# EAGLE schematic lm317_voltage_regulator (EAGLE 6.2)
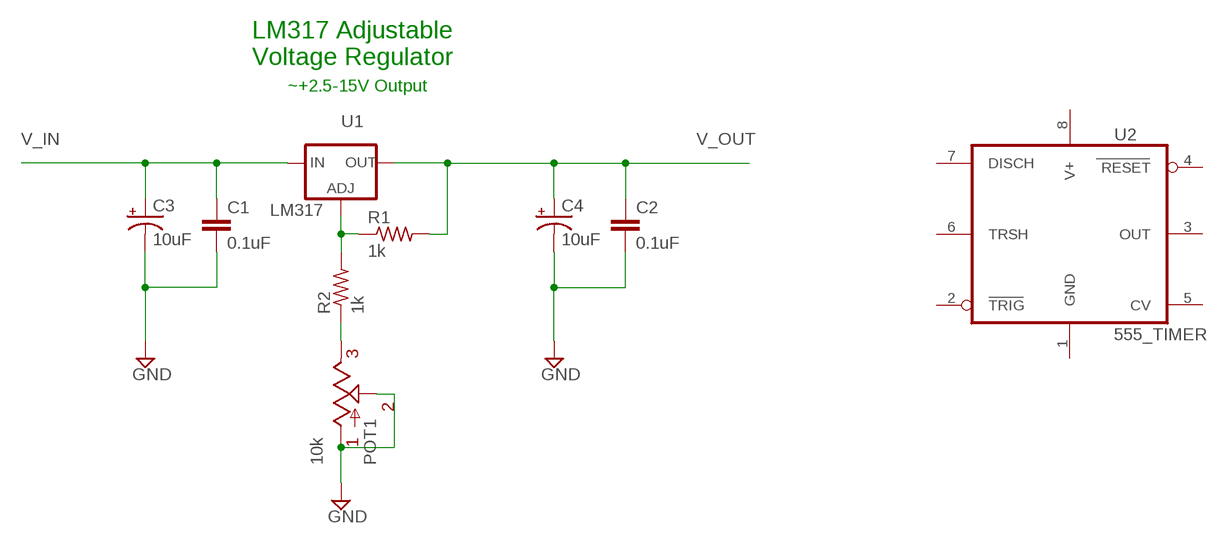
[diagram p0: schematic, sheet 1]

## Parts
C1  0.1uF  CERAMIC_CAPACITOR  [CERAMIC_CAP]
C2  0.1uF  CERAMIC_CAPACITOR  [CERAMIC_CAP]
C3  10uF  0501  [050_020_1]
C4  10uF  0501  [050_020_1]
POT1  10k  POT  [POT]
R1  1k  RESISTOR  [RESISTOR]
R2  1k  RESISTOR  [RESISTOR]
U1  LM317  V_REG_317SINK  [TO220-ADJ]
U2  555_TIMER  [DIL08]

## Nets
GND: C1.2 C2.2 C3.- C4.- POT1.1 POT1.2
N$1: R1.1 R2.2 U1.ADJ
N$2: POT1.3 R2.1
V_IN: C1.1 C3.+ U1.IN
V_OUT: C2.1 C4.+ R1.2 U1.OUT
Unconnected: U2.2(TRIG) U2.3(OUT) U2.4(RESET) U2.5(CV) U2.6(TRSH) U2.7(DISCH)

## Notes on the sheet
- LM317 Adjustable
- Voltage Regulator
- ~+2.5-15V Output

## Power pins joined to a net without a drawn wire
GND: U2.1(GND)
V+: U2.8(V+)

## Library data of the parts
C1 C2 = 00_steve:CERAMIC_CAPACITOR
C3 C4 = gm-caps-electro-pol:050: 0.22 - 100uF Xicon values at Mouser.com: 10V: 10 - 100uF; 16V: 2.2 - 47uF; 25V: 0.47 - 47uF; 50V: 0.22 - 22uF
POT1 = 00_steve:POT
R1 R2 = 00_steve:RESISTOR
U1 = SparkFun-3-2-07:V_REG_317: Voltage Regulator Standard LM317 adjustable voltage regulator. AOI (Adjust Output Input). Google 'LM317 Calculator' for easy to use app to get the two resistor values needed. 240/720 for 5V output. 240/390 for 3.3V output. Spark Fun Electronics SKU : IC-VReg-Adj
U2 = 00_steve:555_TIMER